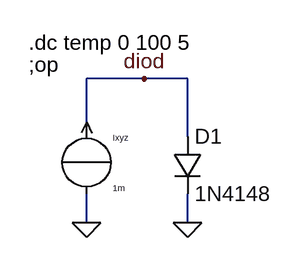
[diagram p0: schematic diode_2.asc]
diode_2.asc, the LTspice schematic file:
Version 4
SHEET 1 880 680
WIRE 176 80 112 80
WIRE 224 80 176 80
WIRE 112 128 112 80
WIRE 224 144 224 80
WIRE 112 240 112 208
WIRE 224 240 224 208
FLAG 112 240 0
FLAG 224 240 0
FLAG 176 80 diod
SYMBOL diode 208 144 R0
SYMATTR InstName D1
SYMATTR Value 1N4148
SYMBOL source-I 112 128 R0
SYMATTR InstName Ixyz
SYMATTR Value 1m
TEXT 48 64 Left 2 !;op
TEXT 48 40 Left 2 !.dc temp 0 100 5

The netlist it stands for:
* diode_2.asc
D1 diod 0 1N4148
Ixyz 0 diod 1m
.model D D
.lib standard.dio
;op
.dc temp 0 100 5
.backanno
.end